# Altium schematic sheet SENSORS.SchDoc
size A4; SheetNumber: 3; SheetTotal: 3
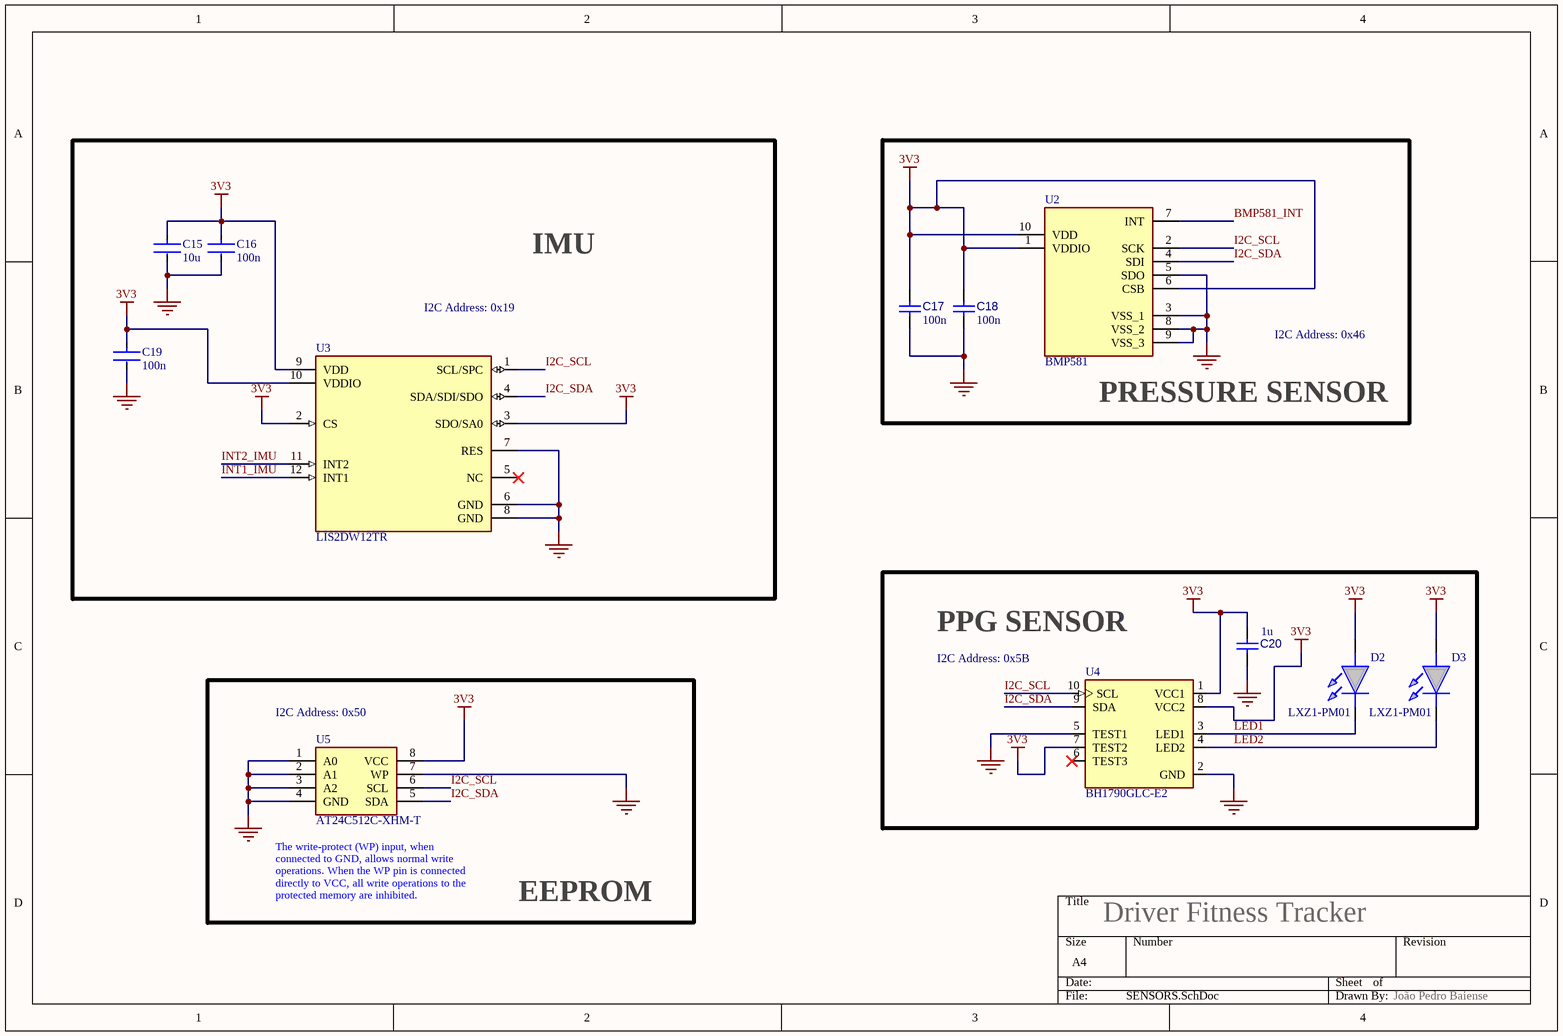
[diagram p0: SENSORS.SchDoc]

## Parts
C15  10u  [FP-C0402-BB-MFG]
C16  100n  [FP-C0402-BB-MFG]
C17  100n  [CAPC1608X90X40NL10T20]
C18  100n  [CAPC1608X90X40NL10T20]
C19  100n  [FP-C0402-BB-MFG]
C20  1u  [CAPC1608X90X40NL10T20]
D2  LXZ1-PM01  [LEDC1608X70N]
D3  LXZ1-PM01  [LEDC1608X70N]
U2  BMP581  [BMP581]
U3  LIS2DW12TR  [FP-LGA12-DM00170568-MFG]
U4  BH1790GLC-E2  [PQFN70P280X280X100-10N]
U5  AT24C512C-XHM-T  [SOP65P640X120-8N]

## Blocks framed on the sheet
IMU: C15 C16 C19 U3
PRESSURE SENSOR: C17 C18 U2
PPG SENSOR: C20 D2 D3 U4
EEPROM: U5

## Nets
3V3: C15.1 C16.1 C17.2 C18.2 C19.1 C20.1 D2.2(A) D3.2(A) U2.1(VDDIO) U2.6(CSB) U2.10(VDD) U3.2(CS) U3.3(SDO/SA0) U3.9(VDD) U3.10(VDDIO) U4.1(VCC1) U4.7(TEST2) U4.8(VCC2) U5.8(VCC)
GND: C15.2 C16.2 C17.1 C18.1 C19.2 C20.2 U2.3(VSS_1) U2.5(SDO) U2.8(VSS_2) U2.9(VSS_3) U3.6(GND) U3.7(RES) U3.8(GND) U4.2(GND) U4.5(TEST1) U5.1(A0) U5.2(A1) U5.3(A2) U5.4(GND) U5.7(WP)
BMP581_INT: U2.7(INT)
I2C_SCL: U2.2(SCK) U3.1(SCL/SPC) U4.10(SCL) U5.6(SCL)
I2C_SDA: U2.4(SDI) U3.4(SDA/SDI/SDO) U4.9(SDA) U5.5(SDA)
INT1_IMU: U3.12(INT1)
INT2_IMU: U3.11(INT2)
LED1: D2.1(K) U4.3(LED1)
LED2: D3.1(K) U4.4(LED2)

Not connected (* = marked no-connect by the designer): U3 5(NC)*; U4 6(TEST3)*

## Notes on the sheet
- I2C Address: 0x19
- I2C Address: 0x46
- (near U5) I2C Address: 0x50
- (near U4) I2C Address: 0x5B
- (near U5) The write-protect (WP) input, when connected to GND, allows normal write operations. When the WP pin is connected
  directly to VCC, all write operations to the protected memory are inhibited.
- Driver Fitness Tracker
- João Pedro Baiense

## Library data of the parts
C15 = CMP-2008-02046-2: Multilayer Ceramic Capacitors MLCC - SMD/SMT 10 uF 6.3 VDC 20% 0402 X5R; Manufacturer: Kemet; CorrectManufacturer: GRM155R60J106ME05D; Capacitance: 0.10 μF; Temperature Coefficient: 15%; Tolerance: 0.1; Voltage Rating: 10 V; Value: 0.10 μF; Material: Ceramic; Package: C0402-BB; Temperature: -55°C to +125°C; ComponentLink2Description: Datasheet; Temperature Characteristic: X5R; Device Class L1: Passive Components; Height: 0.55mm; Lead Free: Yes; ComponentLink2URL: https://content.kemet.com/datasheets/KEM_C1002_X7R_SMD.pdf; Device Class L2: Capacitors; Temperature Range Low: -55°C; Temperature Range High: +125°C; RoHS: TRUE; Octopart: https://octopart.com/c0402c104k8pactu-kemet-140039; Automotive: No; Mouser Description: Capacitor 100 nF 10 VDC 0402; Category: Cap; Digikey Description: CAP CER 0.1UF 10V X5R 0402; Ipc Land Pattern Name: CAPC10050X50; Device Class L3: Ceramic Capacitors; JLCPCB Part #: C19702
C16 C19 = CMP-2008-02046-2: Multilayer Ceramic Capacitors MLCC - SMD/SMT NEW GLOBAL PN KGM05CR71H104KN 50V 0.1uF X7R 0402 10%; Manufacturer: Kemet; CorrectManufacturer: 04025C104KAT4A; Capacitance: 0.10 μF; Temperature Characteristic: X5R; Temperature Coefficient: 15%; Tolerance: 0.1; Voltage Rating: 10 V; Value: 0.10 μF; Material: Ceramic; Package: C0402-BB; Temperature: -55°C to +125°C; ComponentLink2Description: Datasheet; Device Class L1: Passive Components; Height: 0.55mm; Lead Free: Yes; ComponentLink2URL: https://content.kemet.com/datasheets/KEM_C1002_X7R_SMD.pdf; Device Class L2: Capacitors; Temperature Range Low: -55°C; Temperature Range High: +125°C; RoHS: TRUE; Octopart: https://octopart.com/c0402c104k8pactu-kemet-140039; Automotive: No; Mouser Description: Capacitor 100 nF 10 VDC 0402; Category: Cap; Digikey Description: CAP CER 0.1UF 10V X5R 0402; Ipc Land Pattern Name: CAPC10050X50; Device Class L3: Ceramic Capacitors; JLCPCB Part #: C1523
C17 C18 = CMP-001-00017-6: Multilayer Ceramic Capacitors MLCC - SMD/SMT 50V 0.1 uF X7R 0603 10% AEC-Q200; CorrectManufacturer: KAM15AR71H104KT; Tolerance: 10%; Voltage Rating: 50V; Mounting Technology: SM; Value: 100n; Max Operating Temperature: 125°C; RoHS Compliant: True; Pins: 2; Capacitor Type: Ceramic; Case/Package: 0603; JLCPCB Part #: C1523
C20 = CMP-001-00017-6: Multilayer Ceramic Capacitors MLCC - SMD/SMT 50V 1uF X7R 0603 10%; CorrectManufacturer: 06035C105KAT2A; Tolerance: 10%; Voltage Rating: 50V; Mounting Technology: SM; Value: 1u; Max Operating Temperature: 125°C; RoHS Compliant: True; Pins: 2; Capacitor Type: Ceramic; Case/Package: 0603; JLCPCB Part #: C15849
D2 = LED_19-217/GHC-YR1S2/3T: Standard LEDs - SMD Brilliant Green Everlight; Geometry.Height: 0.96mm; Mouser Part Number: 638-19217GHCYR1S23T; Mouser Price/Stock: https://pt.mouser.com/ProductDetail/Everlight/19-217-GHC-YR1S2-3T?qs=8cKuZ6Ok2lZjmFTUzVFjDg%3D%3D; Manufacturer_Name: Everlight; CorrectManufacturer: 19-217/GHC-YR1S2/3T; Datasheet Link: https://pt.mouser.com/datasheet/2/143/19-217-GHC-YR1S2-3T-1663276.pdf; JLCPCB Link: https://jlcpcb.com/partdetail/EverlightElec-19_217_GHC_YR1S23T/C72043; Available at JLCPCB?: Yes; JLCPCB Part #: C72043
D3 = LED_19-217/GHC-YR1S2/3T: High Power LEDs - Single Color Green; Manufacturer_Name: Everlight; Geometry.Height: 0.96mm; Mouser Part Number: 638-19217GHCYR1S23T; Mouser Price/Stock: https://pt.mouser.com/ProductDetail/Everlight/19-217-GHC-YR1S2-3T?qs=8cKuZ6Ok2lZjmFTUzVFjDg%3D%3D; CorrectManufacturer: 19-217/GHC-YR1S2/3T; Datasheet Link: https://pt.mouser.com/datasheet/2/143/19-217-GHC-YR1S2-3T-1663276.pdf; JLCPCB Link: https://jlcpcb.com/partdetail/EverlightElec-19_217_GHC_YR1S23T/C72043; Available at JLCPCB?: Yes; JLCPCB Part #: C72043
U2 = BMP581: Board Mount Pressure Sensors The BMP581 is a very small, low-power and low-noise 24-bit absolute barometric pressure sensor; Manufacturer_Name: BOSCH; Geometry.Height: 0.8mm; Mouser Part Number: 262-BMP581; Mouser Price/Stock: https://www.mouser.co.uk/ProductDetail/Bosch-Sensortec/BMP581?qs=Li%252BoUPsLEntPL9tlFmcgXg%3D%3D; CorrectManufacturer: BMP581; Datasheet Link: https://www.bosch-sensortec.com/media/boschsensortec/downloads/datasheets/bst-bmp581-ds004.pdf
U3 = CMP-12175-000006-1: ACCEL 2-16G I2C/SPI 12LGA STMicroelectronics; Min Supply Voltage: 1.62V; Operating Supply Current: 0.38-90uA; Sensor Output: I2C,SPI; Accel Resolution: 14bits; Max Supply Voltage: 3.6V; Accel Range: 2/4/8/16g; Height: 0.7mm; Device Class L1: Sensors; RoHS: TRUE; Temperature Range Low: -40°C; Category: IC; Mouser Description: Accelerometer Triple ±2g/±4g/±8g/±16g 1.62V to 3.6V 0.244mg/digit/0.488mg/digit/0.976mg/digit/1.952mg/digit 12-Pin LG...; Digikey Description: ACCEL 2-16G I2C/SPI 12LGA; ComponentLink2URL: https://www.st.com/resource/en/datasheet/lis2dw12.pdf; Automotive: No; CorrectManufacturer: LIS2DW12TR; Lead Free: Yes; Footprint Url: https://www.st.com/content/ccc/resource/technical/document/technical_note/73/17/9c/16/dd/96/4a/01/CD00134799.pdf/files/CD00134799.pdf/jcr:content/translations/en.CD00134799.pdf; Temperature: -40°C to +85°C; Device Class L3: Accelerometers; Package: LGA12-DM00170568; Temperature Range High: +85°C; Device Class L2: Motion Sensors; Octopart: https://octopart.com/lis2dw12tr-stmicroelectronics-77080925; ComponentLink2Description: Datasheet; Manufacturer: STMicroelectronics; JLCPCB Link: https://jlcpcb.com/partdetail/Stmicroelectronics-LIS2DW12TR/C189624; JLCPCB Part #: C189624
U4 = BH1790GLC-E2: Light To Frequency & Light To Voltage Opt Sensr Heart Rate Monitor IC 200uA; MF: Rohm; Package: LGA-10 Rohm; CorrectManufacturer: BH1790GLC-E2; Mouser-Purchase-URL: https://snapeda.com/shop?store=Mouser&id=2761766; Price: None; Availability: Warning; Value: *; SnapEDA_Link: https://www.snapeda.com/parts/BH1790GLC-E2/Rohm/view-part/2761766/?ref=snap; JLCPCB Link: None; Available at JLCPCB?: No
U5 = AT24C512C-XHM-T: EEPROM SERIAL EEPROM 512K (64K X 8) 2WIRE 1.7V; Manufacturer_Name: Microchip; Geometry.Height: 1.2mm; Mouser Part Number: 556-AT24C512C-XHM-T; Mouser Price/Stock: https://www.mouser.co.uk/ProductDetail/Microchip-Technology/AT24C512C-XHM-T?qs=rNaVQffb%252BteaIrq7vigEzw%3D%3D; CorrectManufacturer: AT24C512C-XHM-T; Datasheet Link: https://ww1.microchip.com/downloads/en/DeviceDoc/20006161B.pdf; Available at JLCPCB?: YES; JLCPCB Linkl: https://jlcpcb.com/partdetail/MicrochipTech-AT24C512C_XHMT/C111546; JLCPCB Part #: C111546